# Altium schematic sheet usb.SchDoc
size A4
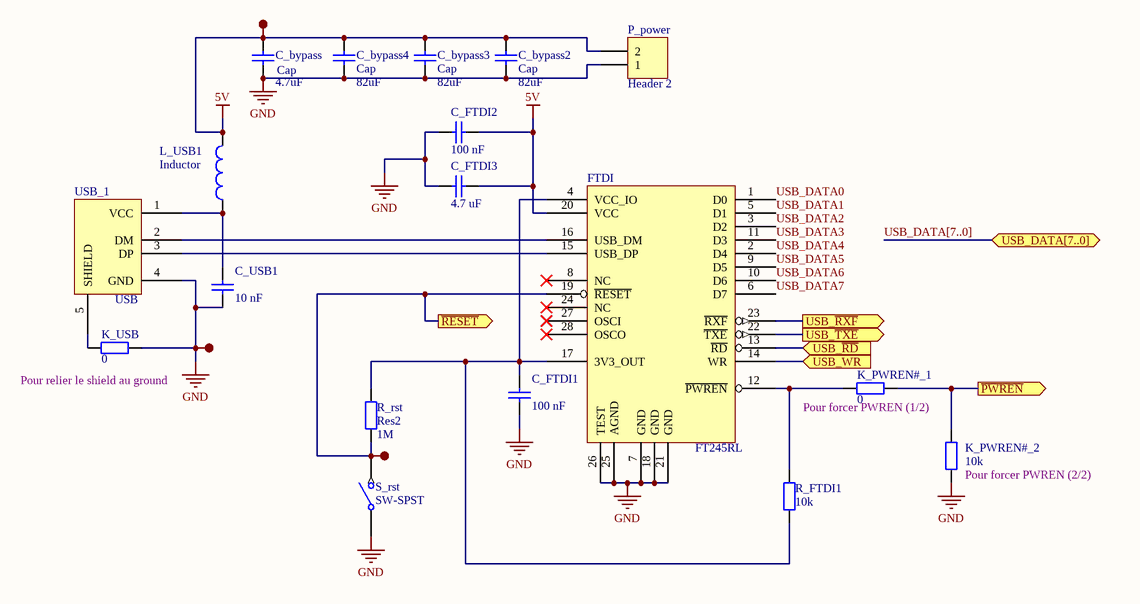
[diagram p0: usb.SchDoc]

## Parts
C_bypass  Cap  value 4.7uF  [0805]
C_bypass2  Cap  value 82uF  [Capacitor_bypass]
C_bypass3  Cap  value 82uF  [Capacitor_bypass]
C_bypass4  Cap  value 82uF  [Capacitor_bypass]
C_FTDI1  value 100 nF  [0805]  (hidden comment: Cap)
C_FTDI2  value 100 nF  [0805]  (hidden comment: Cap)
C_FTDI3  value 4.7 uF  [0805]  (hidden comment: Cap)
C_USB1  value 10 nF  [0805]  (hidden comment: Cap)
FTDI  FT245RL  [SSOP28]
K_PWREN#_1  value 0  [0805]  (hidden comment: Res2)
K_PWREN#_2  value 10k  [0805]  (hidden comment: Res2)
K_USB  value 0  [0805]  (hidden comment: Res2)
L_USB1  Inductor  [0805]
P_power  Header 2  [HDR1X2]
R_FTDI1  value 10k  [0805]  (hidden comment: Res2)
R_rst  Res2  value 1M  [0805]
S_rst  SW-SPST  [0805]
TP_5v  TestPoint  [testpoint]  (value not drawn)
TP_gnd  TestPoint  [testpoint]  (value not drawn)
TP_reset  TestPoint  [testpoint]  (value not drawn)
USB_1  USB  [USB2.5-2H4E]

## Ports
USB_DATA[7..0] (bidir), USB_WR (in), USB_~{RD} (in), USB_~{RXF} (out), USB_~{TXE} (out), ~{PWREN} (out), ~{RESET} (out)

## Nets
5V: C_bypass.1 C_bypass2.1 C_bypass3.1 C_bypass4.1 C_FTDI2.2 C_FTDI3.2 FTDI.20(VCC) L_USB1.2 P_power.2 TP_5v.1(TP)
GND: C_bypass.2 C_bypass2.2 C_bypass3.2 C_bypass4.2 C_FTDI1.2 C_FTDI2.1 C_FTDI3.1 C_USB1.2 FTDI.7(GND) FTDI.18(GND) FTDI.21(GND) FTDI.25(AGND) FTDI.26(TEST) K_PWREN#_2.2 K_USB.2 P_power.1 S_rst.1(COMMON) TP_gnd.1(TP) USB_1.4(GND)
~{PWREN}: K_PWREN#_1.2 K_PWREN#_2.1 ; port ~{PWREN}
~{RESET}: FTDI.19(~{RESET}) R_rst.1 S_rst.2(NO) TP_reset.1(TP) ; port ~{RESET}
USB_DATA0: FTDI.1(D0)
USB_DATA1: FTDI.5(D1)
USB_DATA2: FTDI.3(D2)
USB_DATA3: FTDI.11(D3)
USB_DATA4: FTDI.2(D4)
USB_DATA5: FTDI.9(D5)
USB_DATA6: FTDI.10(D6)
USB_DATA7: FTDI.6(D7)
USB_~{RD}: FTDI.13(~{RD}) ; port USB_~{RD}
USB_~{RXF}: FTDI.23(~{RXF}) ; port USB_~{RXF}
USB_~{TXE}: FTDI.22(~{TXE}) ; port USB_~{TXE}
USB_WR: FTDI.14(WR) ; port USB_WR
NetC_FTDI1_1: C_FTDI1.1 FTDI.4(VCC_IO) FTDI.17(3V3_OUT) R_FTDI1.2 R_rst.2
NetC_USB1_1: C_USB1.1 L_USB1.1 USB_1.1(VCC)
NetFTDI_12: FTDI.12(~{PWREN}) K_PWREN#_1.1 R_FTDI1.1
NetFTDI_15: FTDI.15(USB_DP) USB_1.3(DP)
NetFTDI_16: FTDI.16(USB_DM) USB_1.2(DM)
NetK_USB_1: K_USB.1 USB_1.5(SHIELD)

Not connected (* = marked no-connect by the designer): FTDI 8(NC)* 24(NC)* 27(OSCI)* 28(OSCO)*

## Buses and harness runs
bus USB_DATA[7..0] = port USB_DATA[7..0]

## Notes on the sheet
- Pour relier le shield au ground
- (near K_PWREN#_1) Pour forcer PWREN (1/2)
- (near K_PWREN#_2) Pour forcer PWREN (2/2)

## Library data of the parts
C_bypass C_bypass2-C_bypass4 C_FTDI1-C_FTDI3 C_USB1 = Cap: Capacitor; Published: 8-Jun-2000; LatestRevisionDate: 17-Jul-2002; LatestRevisionNote: Re-released for DXP Platform.; PackageReference: RAD-0.3; Publisher: Altium Limited
K_PWREN#_1 K_PWREN#_2 K_USB R_FTDI1 R_rst = Res2: Resistor; Published: 8-Jun-2000; LatestRevisionDate: 17-Jul-2002; LatestRevisionNote: Re-released for DXP Platform.; PackageReference: AXIAL-0.4; Publisher: Altium Limited
L_USB1 = Inductor: Code_IEC: 1005; Published: 8-Jun-2000; LatestRevisionDate: 29-May-2009; LatestRevisionNote: IPC-7351 Footprint Added.; PackageReference: 0402-A; Publisher: Altium Limited; PackageDescription: Chip Inductor; Code_JEITA: 0402
P_power = Header 2: Header, 2-Pin; LatestRevisionDate: 17-Jul-2002; LatestRevisionNote: Re-released for DXP Platform.; Publisher: Altium Limited
S_rst = SW-SPST: Single-Pole, Single-Throw Switch; Published: 24-Mar-1999; LatestRevisionDate: 17-Jul-2002; LatestRevisionNote: Re-released for DXP Platform.; PackageReference: SPST-2; Publisher: Altium Limited